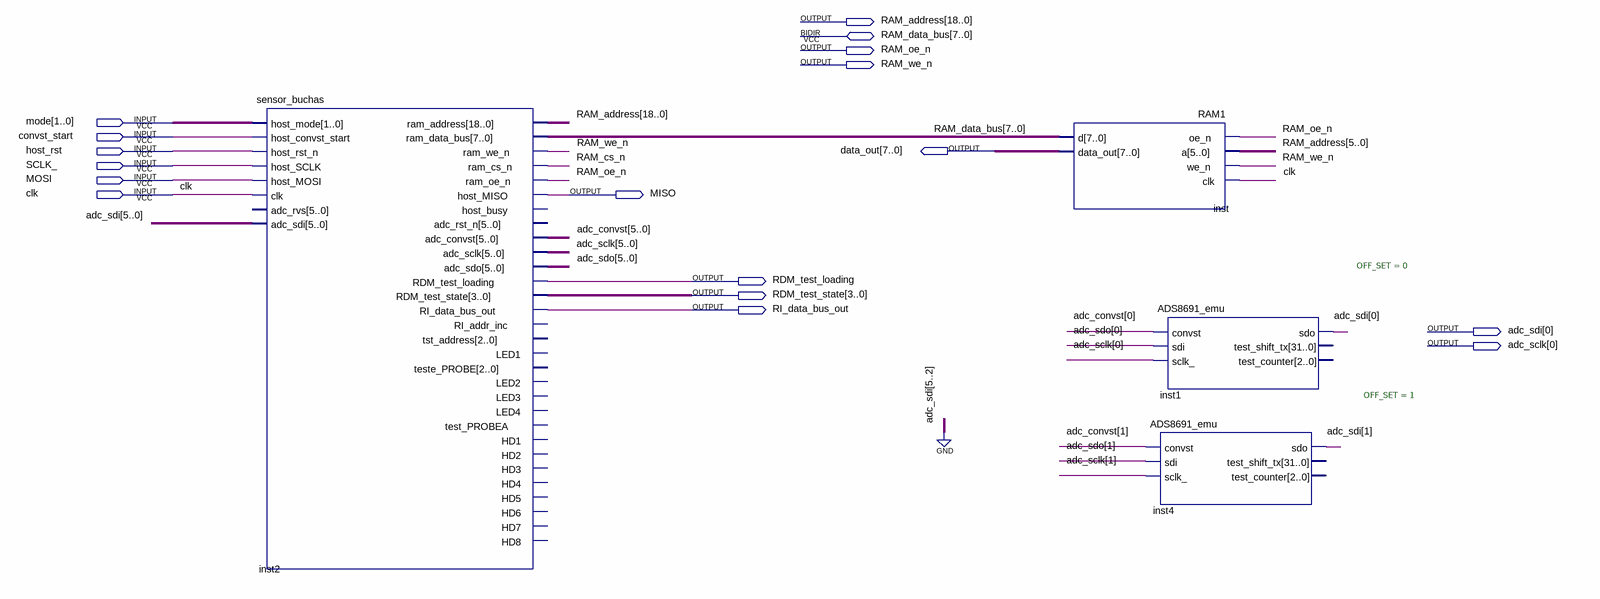
[diagram p0: schematic sheet]
// Quartus schematic teste_aquisicao_com_ram.bdf as structural Verilog: 4 symbols, 17 pins
module teste_aquisicao_com_ram (
  input  [1:0] mode,
  input  convst_start,
  input  host_rst,
  input  SCLK_,
  input  MOSI,
  input  clk,
  inout  [7:0] RAM_data_bus,
  output [18:0] RAM_address,
  output RAM_oe_n,
  output RAM_we_n,
  output [7:0] data_out,
  output MISO,
  output RDM_test_loading,
  output [3:0] RDM_test_state,
  output RI_data_bus_out,
  output [1:0] adc_sdi,
  output [5:0] adc_sclk
);

  wire RAM_cs_n;
  wire [5:0] adc_convst, adc_sdo;

  sensor_buchas inst2 (
    .host_mode(mode), .host_convst_start(convst_start), .host_rst_n(host_rst), .host_SCLK(SCLK_),
    .host_MOSI(MOSI), .clk(clk), .adc_sdi({4'b0000, adc_sdi}), .ram_address(RAM_address),
    .ram_we_n(RAM_we_n), .ram_cs_n(RAM_cs_n), .ram_oe_n(RAM_oe_n), .host_MISO(MISO), .adc_convst(adc_convst),
    .adc_sclk(adc_sclk), .adc_sdo(adc_sdo), .RDM_test_loading(RDM_test_loading),
    .RDM_test_state(RDM_test_state), .RI_data_bus_out(RI_data_bus_out), .ram_data_bus(RAM_data_bus));  // open: adc_rvs, host_busy, adc_rst_n, RI_addr_inc, tst_address, LED1, teste_PROBE, LED2, LED3, LED4, test_PROBEA, HD1, HD2, HD3, HD4, HD5, HD6, HD7, HD8
  RAM1 inst (.oe_n(RAM_oe_n), .a(RAM_address[5:0]), .we_n(RAM_we_n), .clk(clk), .data_out(data_out), .d(RAM_data_bus));
  ADS8691_emu #(.OFF_SET(0)) inst1 (
    .convst(adc_convst[0]), .sdi(adc_sdo[0]), .sclk_(adc_sclk[0]), .sdo(adc_sdi[0]));  // open: test_shift_tx, test_counter
  ADS8691_emu #(.OFF_SET(1)) inst4 (
    .convst(adc_convst[1]), .sdi(adc_sdo[1]), .sclk_(adc_sclk[1]), .sdo(adc_sdi[1]));  // open: test_shift_tx, test_counter
endmodule
